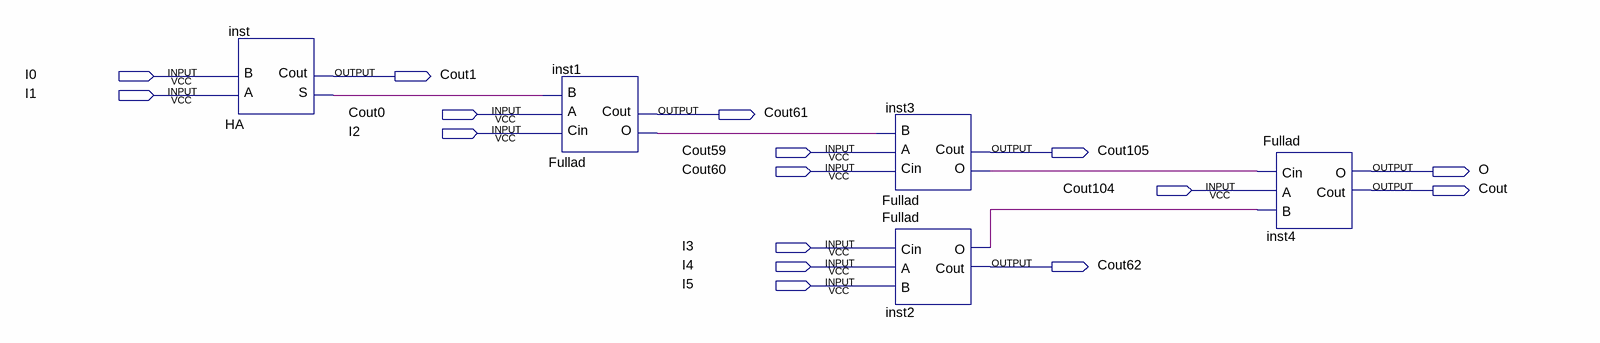
[diagram p0: schematic sheet]
// Quartus schematic B11.bdf as structural Verilog: 5 symbols, 16 pins
module B11 (
  input  I0,
  input  I1,
  input  Cout0,
  input  I2,
  input  Cout59,
  input  Cout60,
  input  Cout104,
  input  I3,
  input  I4,
  input  I5,
  output Cout1,
  output Cout61,
  output Cout105,
  output O,
  output Cout,
  output Cout62
);

  wire inst1_o, inst2_o, inst3_o, inst_s;

  HA inst (.A(I1), .B(I0), .S(inst_s), .Cout(Cout1));
  Fullad inst1 (.Cin(I2), .A(Cout0), .B(inst_s), .O(inst1_o), .Cout(Cout61));
  Fullad inst3 (.Cin(Cout60), .A(Cout59), .B(inst1_o), .O(inst3_o), .Cout(Cout105));
  Fullad inst2 (.Cin(I3), .A(I4), .B(I5), .O(inst2_o), .Cout(Cout62));
  Fullad inst4 (.Cin(inst3_o), .A(Cout104), .B(inst2_o), .O(O), .Cout(Cout));
endmodule
